# Altium schematic sheet Sheet1.SchDoc
size A0
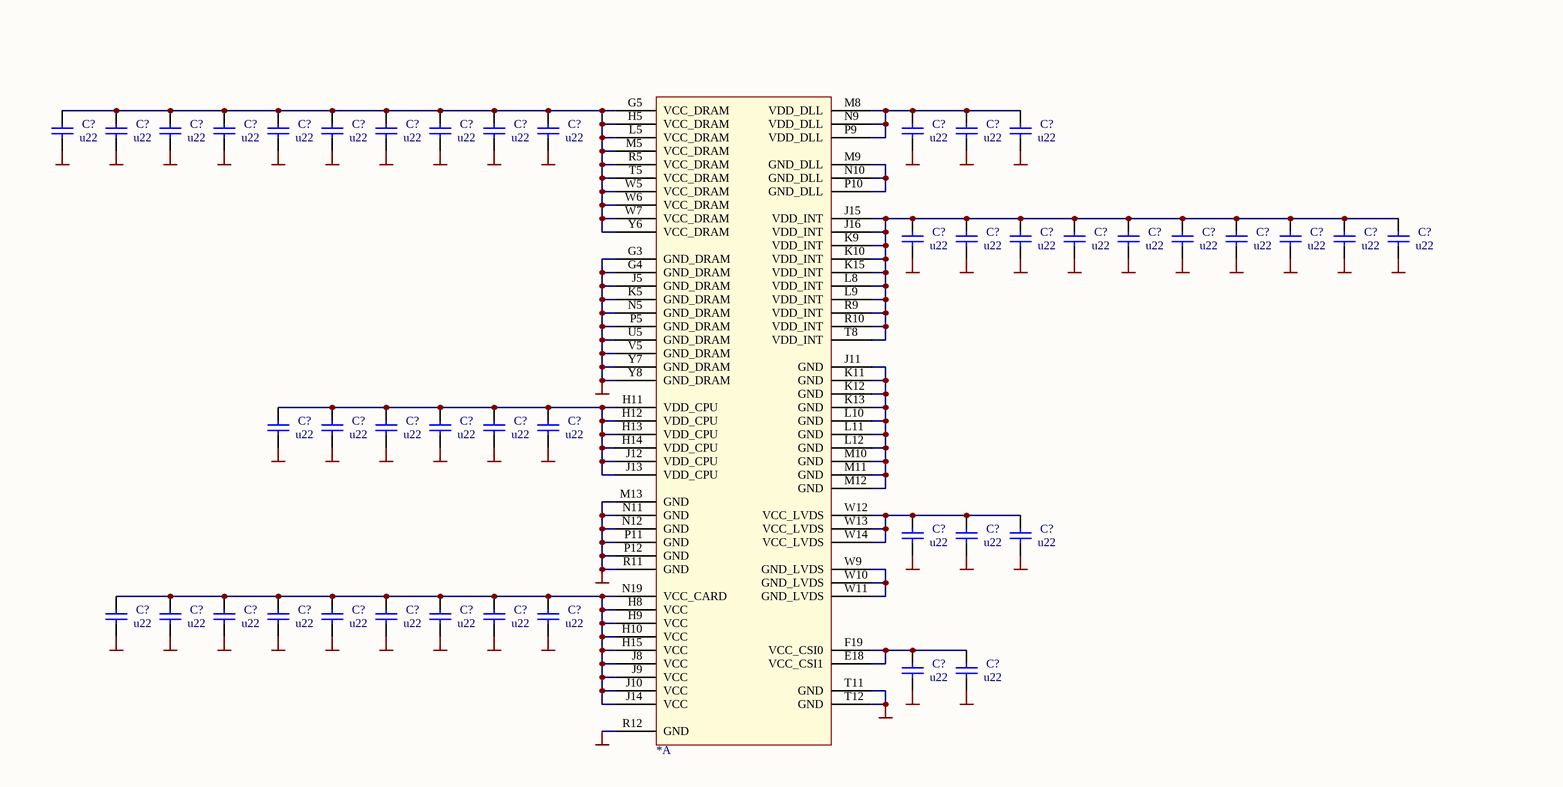
[diagram p0: Sheet1.SchDoc, top left]
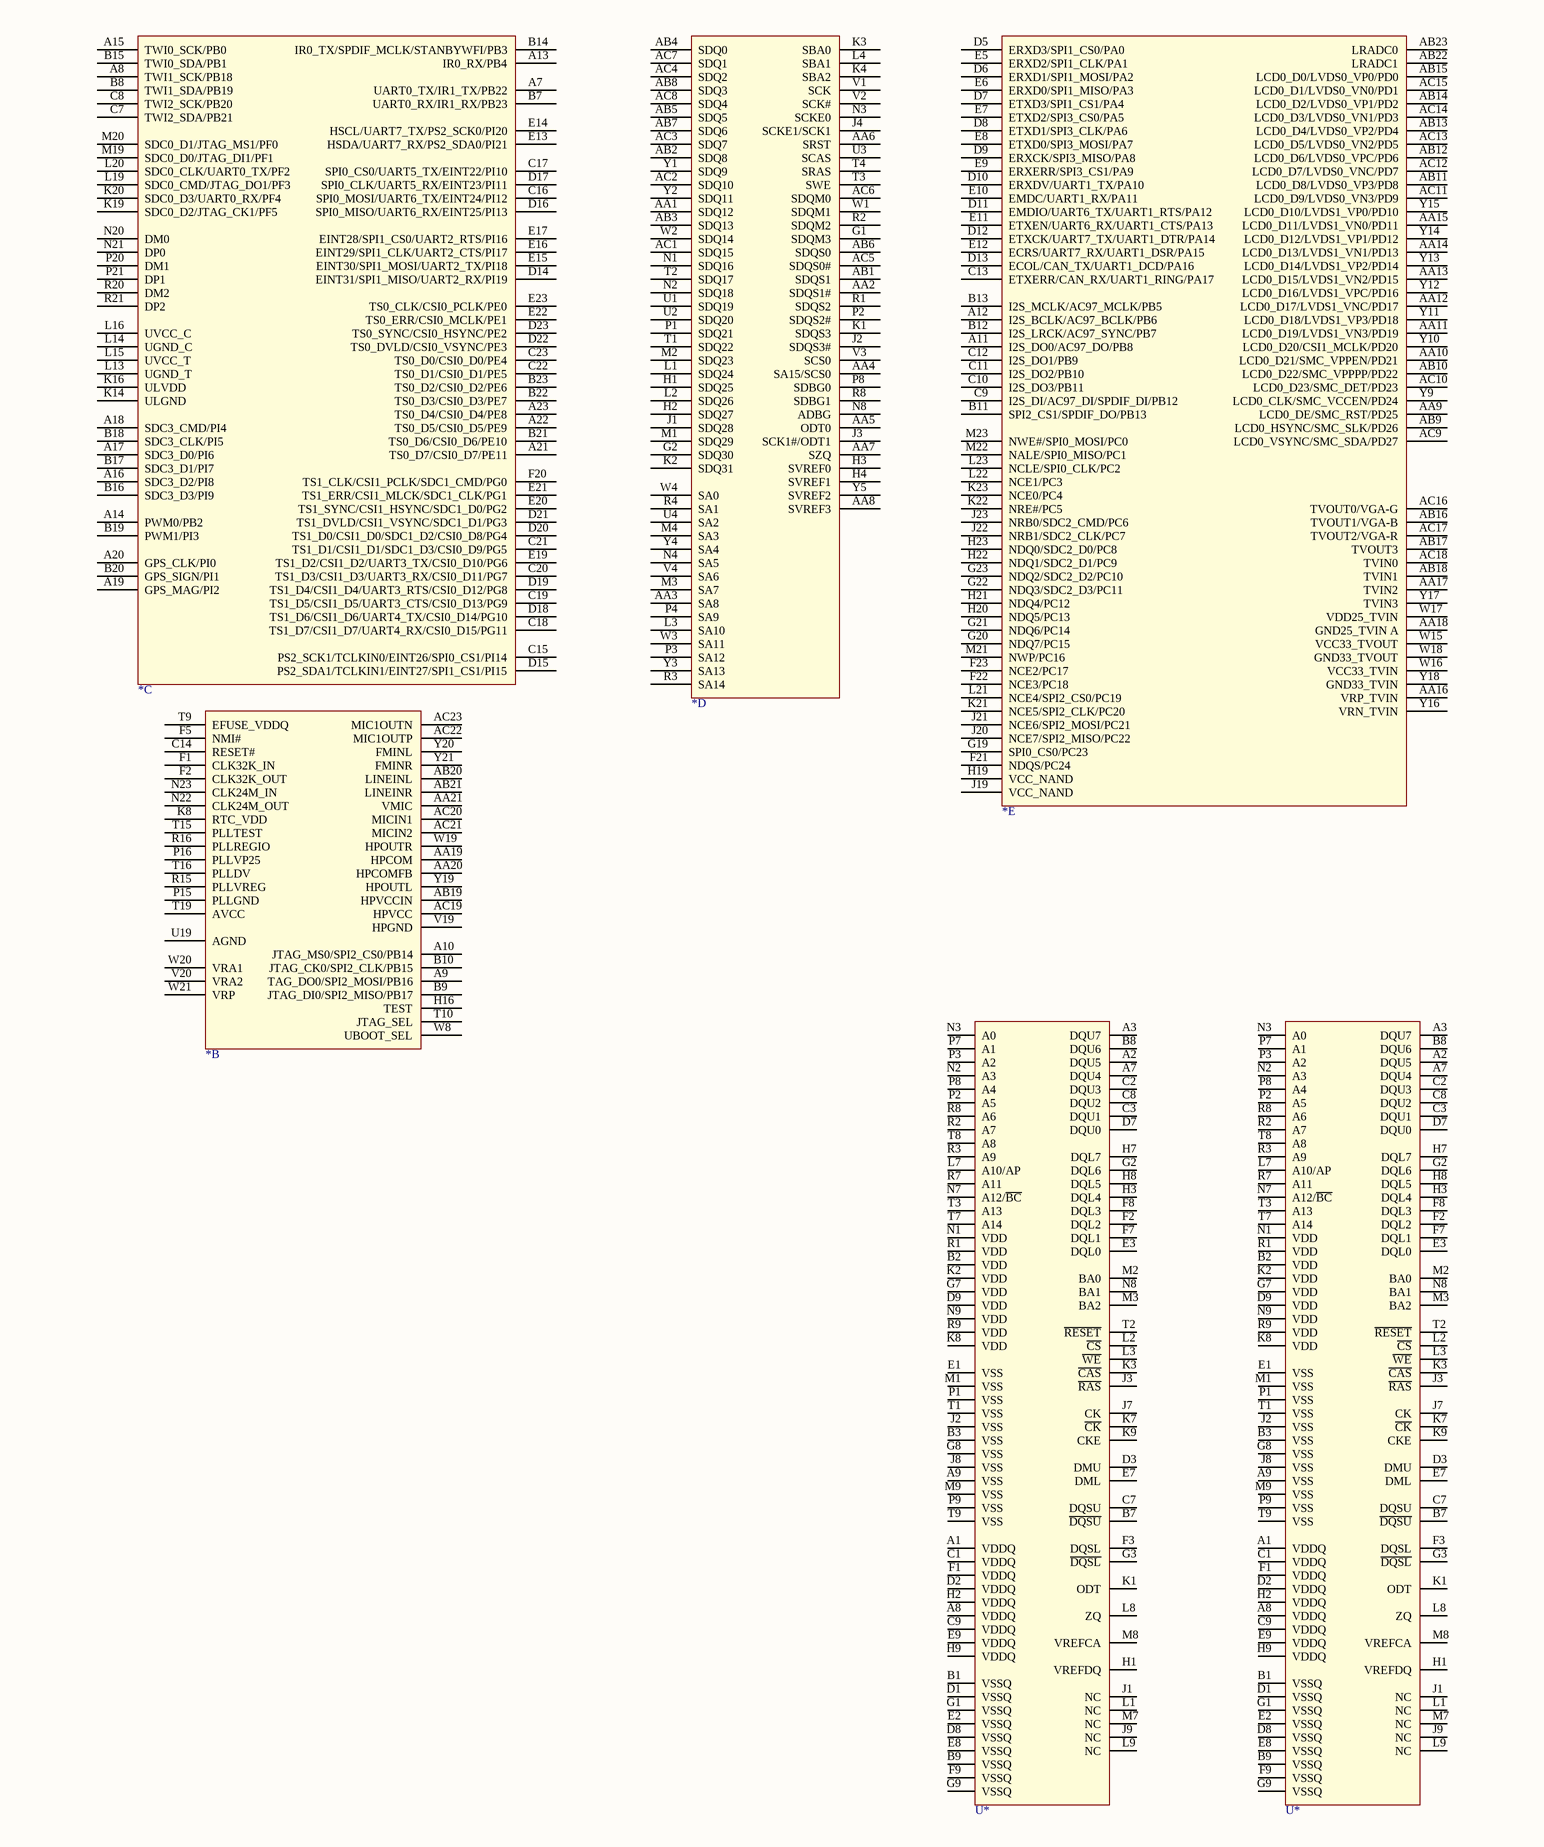
[diagram p1: Sheet1.SchDoc, top right]
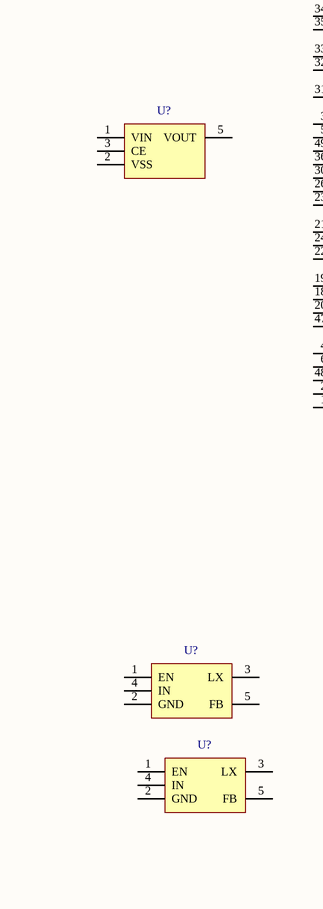
[diagram p2: Sheet1.SchDoc, bottom left]
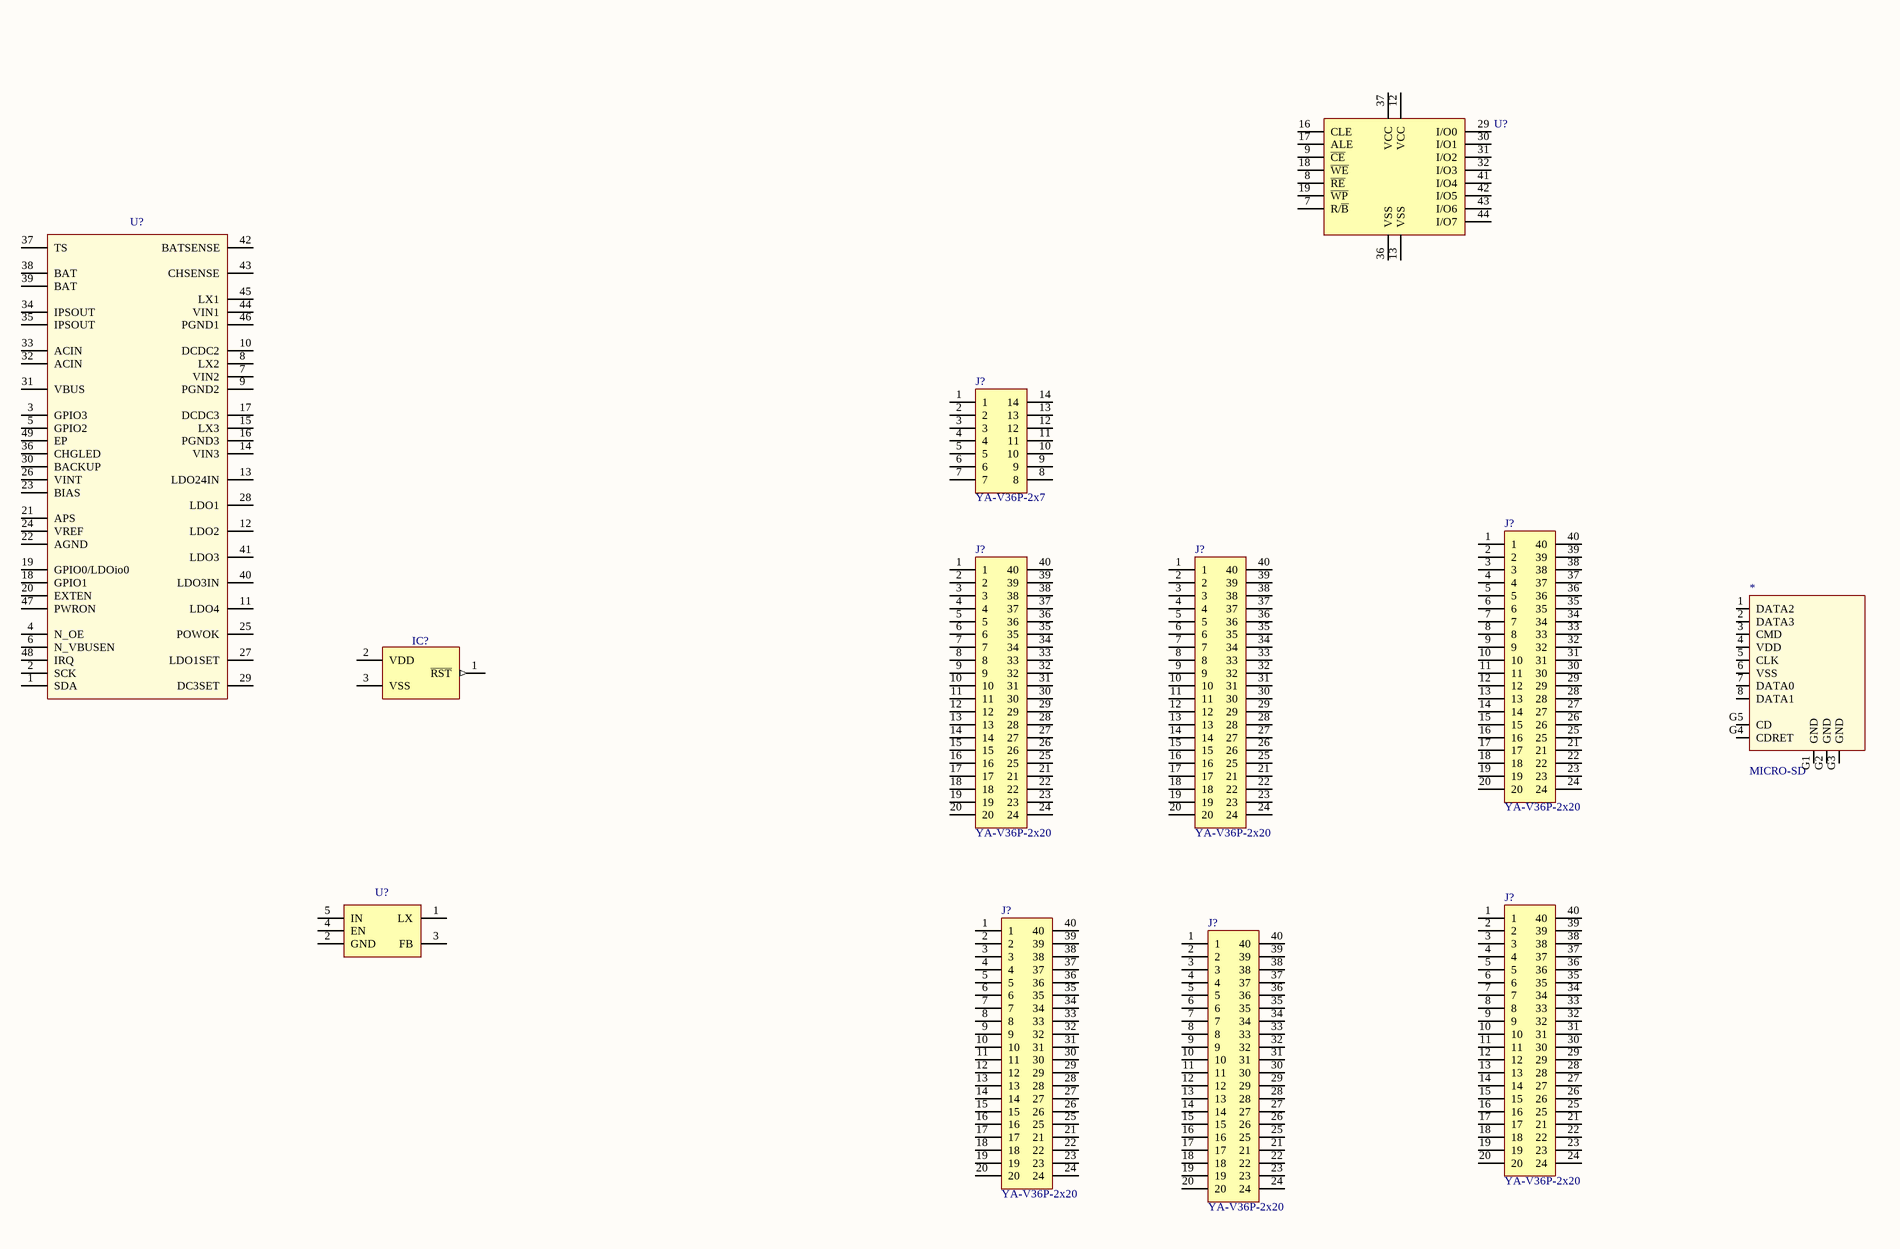
[diagram p3: Sheet1.SchDoc, bottom right]

## Parts
(Parts that share a designator on the sheet are numbered #1, #2 ... from top to bottom, then left to right.)
*#1  A20  [BGA441C80P23X23_1900X1900X140]  (value not drawn)  (part C of 6)
*#2  A20  [BGA441C80P23X23_1900X1900X140]  (value not drawn)  (part D of 6)
*#3  A20  [BGA441C80P23X23_1900X1900X140]  (value not drawn)  (part E of 6)
*#4  A20  [BGA441C80P23X23_1900X1900X140]  (value not drawn)  (part B of 6)
*#5  A20  [BGA441C80P23X23_1900X1900X140]  (value not drawn)  (part A of 6)
*#6  MICRO-SD  [MOLEX_0475710001]
C?#1  u22  [CAPC1005X55N]
C?#2  u22  [CAPC1005X55N]
C?#3  u22  [CAPC1005X55N]
C?#4  u22  [CAPC1005X55N]
C?#5  u22  [CAPC1005X55N]
C?#6  u22  [CAPC1005X55N]
C?#7  u22  [CAPC1005X55N]
C?#8  u22  [CAPC1005X55N]
C?#9  u22  [CAPC1005X55N]
C?#10  u22  [CAPC1005X55N]
C?#11  u22  [CAPC1005X55N]
C?#12  u22  [CAPC1005X55N]
C?#13  u22  [CAPC1005X55N]
C?#14  u22  [CAPC1005X55N]
C?#15  u22  [CAPC1005X55N]
C?#16  u22  [CAPC1005X55N]
C?#17  u22  [CAPC1005X55N]
C?#18  u22  [CAPC1005X55N]
C?#19  u22  [CAPC1005X55N]
C?#20  u22  [CAPC1005X55N]
C?#21  u22  [CAPC1005X55N]
C?#22  u22  [CAPC1005X55N]
C?#23  u22  [CAPC1005X55N]
C?#24  u22  [CAPC1005X55N]
C?#25  u22  [CAPC1005X55N]
C?#26  u22  [CAPC1005X55N]
C?#27  u22  [CAPC1005X55N]
C?#28  u22  [CAPC1005X55N]
C?#29  u22  [CAPC1005X55N]
C?#30  u22  [CAPC1005X55N]
C?#31  u22  [CAPC1005X55N]
C?#32  u22  [CAPC1005X55N]
C?#33  u22  [CAPC1005X55N]
C?#34  u22  [CAPC1005X55N]
C?#35  u22  [CAPC1005X55N]
C?#36  u22  [CAPC1005X55N]
C?#37  u22  [CAPC1005X55N]
C?#38  u22  [CAPC1005X55N]
C?#39  u22  [CAPC1005X55N]
C?#40  u22  [CAPC1005X55N]
C?#41  u22  [CAPC1005X55N]
C?#42  u22  [CAPC1005X55N]
C?#43  u22  [CAPC1005X55N]
IC?  MCP120  [SOT95P237X112-3N]  (value not drawn)
J?#1  YA-V36P-2x7  [YA-V36P-2x7]
J?#2  YA-V36P-2x20  [YA-V36P-2x20]
J?#3  YA-V36P-2x20  [YA-V36P-2x20]
J?#4  YA-V36P-2x20  [YA-V36P-2x20]
J?#5  YA-V36P-2x20  [YA-V36P-2x20]
J?#6  YA-V36P-2x20  [YA-V36P-2x20]
J?#7  YA-V36P-2x20  [YA-V36P-2x20]
U*#1  K4B4G1646D  [BGA96C80P9X16_900X1400X120]  (value not drawn)
U*#2  K4B4G1646D  [BGA96C80P9X16_900X1400X120]  (value not drawn)
U?#1  H27UBG8T2BTR  [BGA96C80P9X16_900X1400X120]  (value not drawn)
U?#2  AXP209  [QFN40P600X600X100-49N-S440]  (value not drawn)
U?#3  AP1231  [SOT95P280X110-5N]  (value not drawn)
U?#4  SY7208  [SOT95P280X145-6N]  (value not drawn)
U?#5  SY8009A  [SOT95P280X110-5N]  (value not drawn)
U?#6  SY8009A  [SOT95P280X110-5N]  (value not drawn)

## Nets
GND: *#5.G3(GND_DRAM) *#5.G4(GND_DRAM) *#5.J5(GND_DRAM) *#5.K5(GND_DRAM) *#5.M13(GND) *#5.N5(GND_DRAM) *#5.N11(GND) *#5.N12(GND) *#5.P5(GND_DRAM) *#5.P11(GND) *#5.P12(GND) *#5.R11(GND) *#5.R12(GND) *#5.T11(GND) *#5.T12(GND) *#5.U5(GND_DRAM) *#5.V5(GND_DRAM) *#5.Y7(GND_DRAM) *#5.Y8(GND_DRAM) C?#1.1 C?#2.1 C?#3.1 C?#4.1 C?#5.1 C?#6.1 C?#7.1 C?#8.1 C?#9.1 C?#10.1 C?#11.1 C?#12.1 C?#13.1 C?#14.1 C?#15.1 C?#16.1 C?#17.1 C?#18.1 C?#19.1 C?#20.1 C?#21.1 C?#22.1 C?#23.1 C?#24.1 C?#25.1 C?#26.1 C?#27.1 C?#28.1 C?#29.1 C?#30.1 C?#31.1 C?#32.1 C?#33.1 C?#34.1 C?#35.1 C?#36.1 C?#37.1 C?#38.1 C?#39.1 C?#40.1 C?#41.1 C?#42.1 C?#43.1
Net*#5_E18: *#5.E18(VCC_CSI1) *#5.F19(VCC_CSI0) C?#42.2 C?#43.2
Net*#5_G5: *#5.G5(VCC_DRAM) *#5.H5(VCC_DRAM) *#5.L5(VCC_DRAM) *#5.M5(VCC_DRAM) *#5.R5(VCC_DRAM) *#5.T5(VCC_DRAM) *#5.W5(VCC_DRAM) *#5.W6(VCC_DRAM) *#5.W7(VCC_DRAM) *#5.Y6(VCC_DRAM) C?#1.2 C?#2.2 C?#3.2 C?#4.2 C?#5.2 C?#6.2 C?#7.2 C?#8.2 C?#9.2 C?#10.2
Net*#5_H8: *#5.H8(VCC) *#5.H9(VCC) *#5.H10(VCC) *#5.H15(VCC) *#5.J8(VCC) *#5.J9(VCC) *#5.J10(VCC) *#5.J14(VCC) *#5.N19(VCC_CARD) C?#33.2 C?#34.2 C?#35.2 C?#36.2 C?#37.2 C?#38.2 C?#39.2 C?#40.2 C?#41.2
Net*#5_H11: *#5.H11(VDD_CPU) *#5.H12(VDD_CPU) *#5.H13(VDD_CPU) *#5.H14(VDD_CPU) *#5.J12(VDD_CPU) *#5.J13(VDD_CPU) C?#24.2 C?#25.2 C?#26.2 C?#27.2 C?#28.2 C?#29.2
Net*#5_J11: *#5.J11(GND) *#5.K11(GND) *#5.K12(GND) *#5.K13(GND) *#5.L10(GND) *#5.L11(GND) *#5.L12(GND) *#5.M10(GND) *#5.M11(GND) *#5.M12(GND)
Net*#5_J15: *#5.J15(VDD_INT) *#5.J16(VDD_INT) *#5.K9(VDD_INT) *#5.K10(VDD_INT) *#5.K15(VDD_INT) *#5.L8(VDD_INT) *#5.L9(VDD_INT) *#5.R9(VDD_INT) *#5.R10(VDD_INT) *#5.T8(VDD_INT) C?#14.2 C?#15.2 C?#16.2 C?#17.2 C?#18.2 C?#19.2 C?#20.2 C?#21.2 C?#22.2 C?#23.2
Net*#5_M8: *#5.M8(VDD_DLL) *#5.N9(VDD_DLL) *#5.P9(VDD_DLL) C?#11.2 C?#12.2 C?#13.2
Net*#5_M9: *#5.M9(GND_DLL) *#5.N10(GND_DLL) *#5.P10(GND_DLL)
Net*#5_W9: *#5.W9(GND_LVDS) *#5.W10(GND_LVDS) *#5.W11(GND_LVDS)
Net*#5_W12: *#5.W12(VCC_LVDS) *#5.W13(VCC_LVDS) *#5.W14(VCC_LVDS) C?#30.2 C?#31.2 C?#32.2

Not connected (* = marked no-connect by the designer): *#1 A7(UART0_TX/IR1_TX/PB22) A8(TWI1_SCK/PB18) A13(IR0_RX/PB4) A14(PWM0/PB2) A15(TWI0_SCK/PB0) A16(SDC3_D2/PI8) A17(SDC3_D0/PI6) A18(SDC3_CMD/PI4) A19(GPS_MAG/PI2) A20(GPS_CLK/PI0) A21(TS0_D7/CSI0_D7/PE11) A22(TS0_D5/CSI0_D5/PE9) A23(TS0_D4/CSI0_D4/PE8) B7(UART0_RX/IR1_RX/PB23) B8(TWI1_SDA/PB19) B14(IR0_TX/SPDIF_MCLK/STANBYWFI/PB3) B15(TWI0_SDA/PB1) B16(SDC3_D3/PI9) B17(SDC3_D1/PI7) B18(SDC3_CLK/PI5) B19(PWM1/PI3) B20(GPS_SIGN/PI1) B21(TS0_D6/CSI0_D6/PE10) B22(TS0_D3/CSI0_D3/PE7) B23(TS0_D2/CSI0_D2/PE6) C7(TWI2_SDA/PB21) C8(TWI2_SCK/PB20) C15(PS2_SCK1/TCLKIN0/EINT26/SPI0_CS1/PI14) C16(SPI0_MOSI/UART6_TX/EINT24/PI12) C17(SPI0_CS0/UART5_TX/EINT22/PI10) C18(TS1_D7/CSI1_D7/UART4_RX/CSI0_D15/PG11) C19(TS1_D5/CSI1_D5/UART3_CTS/CSI0_D13/PG9) C20(TS1_D3/CSI1_D3/UART3_RX/CSI0_D11/PG7) C21(TS1_D1/CSI1_D1/SDC1_D3/CSI0_D9/PG5) C22(TS0_D1/CSI0_D1/PE5) C23(TS0_D0/CSI0_D0/PE4) D14(EINT31/SPI1_MISO/UART2_RX/PI19) D15(PS2_SDA1/TCLKIN1/EINT27/SPI1_CS1/PI15) D16(SPI0_MISO/UART6_RX/EINT25/PI13) D17(SPI0_CLK/UART5_RX/EINT23/PI11) D18(TS1_D6/CSI1_D6/UART4_TX/CSI0_D14/PG10) D19(TS1_D4/CSI1_D4/UART3_RTS/CSI0_D12/PG8) D20(TS1_D0/CSI1_D0/SDC1_D2/CSI0_D8/PG4) D21(TS1_DVLD/CSI1_VSYNC/SDC1_D1/PG3) D22(TS0_DVLD/CSI0_VSYNC/PE3) D23(TS0_SYNC/CSI0_HSYNC/PE2) E13(HSDA/UART7_RX/PS2_SDA0/PI21) E14(HSCL/UART7_TX/PS2_SCK0/PI20) E15(EINT30/SPI1_MOSI/UART2_TX/PI18) E16(EINT29/SPI1_CLK/UART2_CTS/PI17) E17(EINT28/SPI1_CS0/UART2_RTS/PI16) E19(TS1_D2/CSI1_D2/UART3_TX/CSI0_D10/PG6) E20(TS1_SYNC/CSI1_HSYNC/SDC1_D0/PG2) E21(TS1_ERR/CSI1_MLCK/SDC1_CLK/PG1) E22(TS0_ERR/CSI0_MCLK/PE1) E23(TS0_CLK/CSI0_PCLK/PE0) F20(TS1_CLK/CSI1_PCLK/SDC1_CMD/PG0) K14(ULGND) K16(ULVDD) K19(SDC0_D2/JTAG_CK1/PF5) K20(SDC0_D3/UART0_RX/PF4) L13(UGND_T) L14(UGND_C) L15(UVCC_T) L16(UVCC_C) L19(SDC0_CMD/JTAG_DO1/PF3) L20(SDC0_CLK/UART0_TX/PF2) M19(SDC0_D0/JTAG_DI1/PF1) M20(SDC0_D1/JTAG_MS1/PF0) N20(DM0) N21(DP0) P20(DM1) P21(DP1) R20(DM2) R21(DP2); *#2 AA1(SDQ12) AA2(SDQS1#) AA3(SA8) AA4(SA15/SCS0) AA5(ODT0) AA6(SRST) AA7(SZQ) AA8(SVREF3) AB1(SDQS1) AB2(SDQ8) AB3(SDQ13) AB4(SDQ0) AB5(SDQ5) AB6(SDQS0) AB7(SDQ6) AB8(SDQ3) AC1(SDQ15) AC2(SDQ10) AC3(SDQ7) AC4(SDQ2) AC5(SDQS0#) AC6(SDQM0) AC7(SDQ1) AC8(SDQ4) G1(SDQM3) G2(SDQ30) H1(SDQ25) H2(SDQ27) H3(SVREF0) H4(SVREF1) J1(SDQ28) J2(SDQS3#) J3(SCK1#/ODT1) J4(SCKE1/SCK1) K1(SDQS3) K2(SDQ31) K3(SBA0) K4(SBA2) L1(SDQ24) L2(SDQ26) L3(SA10) L4(SBA1) M1(SDQ29) M2(SDQ23) M3(SA7) M4(SA3) N1(SDQ16) N2(SDQ18) N3(SCKE0) N4(SA5) N8(ADBG) P1(SDQ21) P2(SDQS2#) P3(SA12) P4(SA9) P8(SDBG0) R1(SDQS2) R2(SDQM2) R3(SA14) R4(SA1) R8(SDBG1) T1(SDQ22) T2(SDQ17) T3(SWE) T4(SRAS) U1(SDQ19) U2(SDQ20) U3(SCAS) U4(SA2) V1(SCK) V2(SCK#) V3(SCS0) V4(SA6) W1(SDQM1) W2(SDQ14) W3(SA11) W4(SA0) Y1(SDQ9) Y2(SDQ11) Y3(SA13) Y4(SA4) Y5(SVREF2); *#3 A11(I2S_DO0/AC97_DO/PB8) A12(I2S_BCLK/AC97_BCLK/PB6) AA9(LCD0_DE/SMC_RST/PD25) AA10(LCD0_D21/SMC_VPPEN/PD21) AA11(LCD0_D19/LVDS1_VN3/PD19) AA12(LCD0_D17/LVDS1_VNC/PD17) AA13(LCD0_D15/LVDS1_VN2/PD15) AA14(LCD0_D13/LVDS1_VN1/PD13) AA15(LCD0_D11/LVDS1_VN0/PD11) AA16(VRP_TVIN) AA17(TVIN2) AA18(GND25_TVIN_A) AB9(LCD0_HSYNC/SMC_SLK/PD26) AB10(LCD0_D22/SMC_VPPPP/PD22) AB11(LCD0_D8/LVDS0_VP3/PD8) AB12(LCD0_D6/LVDS0_VPC/PD6) AB13(LCD0_D4/LVDS0_VP2/PD4) AB14(LCD0_D2/LVDS0_VP1/PD2) AB15(LCD0_D0/LVDS0_VP0/PD0) AB16(TVOUT1/VGA-B) AB17(TVOUT3) AB18(TVIN1) AB22(LRADC1) AB23(LRADC0) AC9(LCD0_VSYNC/SMC_SDA/PD27) AC10(LCD0_D23/SMC_DET/PD23) AC11(LCD0_D9/LVDS0_VN3/PD9) AC12(LCD0_D7/LVDS0_VNC/PD7) AC13(LCD0_D5/LVDS0_VN2/PD5) AC14(LCD0_D3/LVDS0_VN1/PD3) AC15(LCD0_D1/LVDS0_VN0/PD1) AC16(TVOUT0/VGA-G) AC17(TVOUT2/VGA-R) AC18(TVIN0) B11(SPI2_CS1/SPDIF_DO/PB13) B12(I2S_LRCK/AC97_SYNC/PB7) B13(I2S_MCLK/AC97_MCLK/PB5) C9(I2S_DI/AC97_DI/SPDIF_DI/PB12) C10(I2S_DO3/PB11) C11(I2S_DO2/PB10) C12(I2S_DO1/PB9) C13(ETXERR/CAN_RX/UART1_RING/PA17) D5(ERXD3/SPI1_CS0/PA0) D6(ERXD1/SPI1_MOSI/PA2) D7(ETXD3/SPI1_CS1/PA4) D8(ETXD1/SPI3_CLK/PA6) D9(ERXCK/SPI3_MISO/PA8) D10(ERXDV/UART1_TX/PA10) D11(EMDIO/UART6_TX/UART1_RTS/PA12) D12(ETXCK/UART7_TX/UART1_DTR/PA14) D13(ECOL/CAN_TX/UART1_DCD/PA16) E5(ERXD2/SPI1_CLK/PA1) E6(ERXD0/SPI1_MISO/PA3) E7(ETXD2/SPI3_CS0/PA5) E8(ETXD0/SPI3_MOSI/PA7) E9(ERXERR/SPI3_CS1/PA9) E10(EMDC/UART1_RX/PA11) E11(ETXEN/UART6_RX/UART1_CTS/PA13) E12(ECRS/UART7_RX/UART1_DSR/PA15) F21(NDQS/PC24) F22(NCE3/PC18) F23(NCE2/PC17) G19(SPI0_CS0/PC23) G20(NDQ7/PC15) G21(NDQ6/PC14) G22(NDQ3/SDC2_D3/PC11) G23(NDQ2/SDC2_D2/PC10) H19(VCC_NAND) H20(NDQ5/PC13) H21(NDQ4/PC12) H22(NDQ1/SDC2_D1/PC9) H23(NDQ0/SDC2_D0/PC8) J19(VCC_NAND) J20(NCE7/SPI2_MISO/PC22) J21(NCE6/SPI2_MOSI/PC21) J22(NRB1/SDC2_CLK/PC7) J23(NRB0/SDC2_CMD/PC6) K21(NCE5/SPI2_CLK/PC20) K22(NRE#/PC5) K23(NCE0/PC4) L21(NCE4/SPI2_CS0/PC19) L22(NCE1/PC3) L23(NCLE/SPI0_CLK/PC2) M21(NWP/PC16) M22(NALE/SPI0_MISO/PC1) M23(NWE#/SPI0_MOSI/PC0) W15(VCC33_TVOUT) W16(VCC33_TVIN) W17(VDD25_TVIN) W18(GND33_TVOUT) Y9(LCD0_CLK/SMC_VCCEN/PD24) Y10(LCD0_D20/CSI1_MCLK/PD20) Y11(LCD0_D18/LVDS1_VP3/PD18) Y12(LCD0_D16/LVDS1_VPC/PD16) Y13(LCD0_D14/LVDS1_VP2/PD14) Y14(LCD0_D12/LVDS1_VP1/PD12) Y15(LCD0_D10/LVDS1_VP0/PD10) Y16(VRN_TVIN) Y17(TVIN3) Y18(GND33_TVIN); *#4 A9(TAG_DO0/SPI2_MOSI/PB16) A10(JTAG_MS0/SPI2_CS0/PB14) AA19(HPCOM) AA20(HPCOMFB) AA21(VMIC) AB19(HPVCCIN) AB20(LINEINL) AB21(LINEINR) AC19(HPVCC) AC20(MICIN1) AC21(MICIN2) AC22(MIC1OUTP) AC23(MIC1OUTN) B9(JTAG_DI0/SPI2_MISO/PB17) B10(JTAG_CK0/SPI2_CLK/PB15) C14(RESET#) F1(CLK32K_IN) F2(CLK32K_OUT) F5(NMI#) H16(TEST) K8(RTC_VDD) N22(CLK24M_OUT) N23(CLK24M_IN) P15(PLLGND) P16(PLLVP25) R15(PLLVREG) R16(PLLREGIO) T9(EFUSE_VDDQ) T10(JTAG_SEL) T15(PLLTEST) T16(PLLDV) T19(AVCC) U19(AGND) V19(HPGND) V20(VRA2) W8(UBOOT_SEL) W19(HPOUTR) W20(VRA1) W21(VRP) Y19(HPOUTL) Y20(FMINL) Y21(FMINR); *#6 1(DATA2) 2(DATA3) 3(CMD) 4(VDD) 5(CLK) 6(VSS) 7(DATA0) 8(DATA1) G1(GND) G2(GND) G3(GND) G4(CDRET) G5(CD); IC? 1(~{RST}) 2(VDD) 3(VSS); J?#1 1 2 3 4 5 6 7 8 9 10 11 12 13 14; J?#2 1 2 3 4 5 6 7 8 9 10 11 12 13 14 15 16 17 18 19 20 21 22 23 24 25 26 27 28 29 30 31 32 33 34 35 36 37 38 39 40; J?#3 1 2 3 4 5 6 7 8 9 10 11 12 13 14 15 16 17 18 19 20 21 22 23 24 25 26 27 28 29 30 31 32 33 34 35 36 37 38 39 40; J?#4 1 2 3 4 5 6 7 8 9 10 11 12 13 14 15 16 17 18 19 20 21 22 23 24 25 26 27 28 29 30 31 32 33 34 35 36 37 38 39 40; J?#5 1 2 3 4 5 6 7 8 9 10 11 12 13 14 15 16 17 18 19 20 21 22 23 24 25 26 27 28 29 30 31 32 33 34 35 36 37 38 39 40; J?#6 1 2 3 4 5 6 7 8 9 10 11 12 13 14 15 16 17 18 19 20 21 22 23 24 25 26 27 28 29 30 31 32 33 34 35 36 37 38 39 40; J?#7 1 2 3 4 5 6 7 8 9 10 11 12 13 14 15 16 17 18 19 20 21 22 23 24 25 26 27 28 29 30 31 32 33 34 35 36 37 38 39 40; U*#1 A1(VDDQ) A2(DQU5) A3(DQU7) A7(DQU4) A8(VDDQ) A9(VSS) B1(VSSQ) B2(VDD) B3(VSS) B7(~{DQSU}) B8(DQU6) B9(VSSQ) C1(VDDQ) C2(DQU3) C3(DQU1) C7(DQSU) C8(DQU2) C9(VDDQ) D1(VSSQ) D2(VDDQ) D3(DMU) D7(DQU0) D8(VSSQ) D9(VDD) E1(VSS) E2(VSSQ) E3(DQL0) E7(DML) E8(VSSQ) E9(VDDQ) F1(VDDQ) F2(DQL2) F3(DQSL) F7(DQL1) F8(DQL3) F9(VSSQ) G1(VSSQ) G2(DQL6) G3(~{DQSL}) G7(VDD) G8(VSS) G9(VSSQ) H1(VREFDQ) H2(VDDQ) H3(DQL4) H7(DQL7) H8(DQL5) H9(VDDQ) J1(NC) J2(VSS) J3(~{RAS}) J7(CK) J8(VSS) J9(NC) K1(ODT) K2(VDD) K3(~{CAS}) K7(~{CK}) K8(VDD) K9(CKE) L1(NC) L2(~{CS}) L3(~{WE}) L7(A10/AP) L8(ZQ) L9(NC) M1(VSS) M2(BA0) M3(BA2) M7(NC) M8(VREFCA) M9(VSS) N1(VDD) N2(A3) N3(A0) N7(A12/~{BC}) N8(BA1) N9(VDD) P1(VSS) P2(A5) P3(A2) P7(A1) P8(A4) P9(VSS) R1(VDD) R2(A7) R3(A9) R7(A11) R8(A6) R9(VDD) T1(VSS) T2(~{RESET}) T3(A13) T7(A14) T8(A8) T9(VSS); U*#2 A1(VDDQ) A2(DQU5) A3(DQU7) A7(DQU4) A8(VDDQ) A9(VSS) B1(VSSQ) B2(VDD) B3(VSS) B7(~{DQSU}) B8(DQU6) B9(VSSQ) C1(VDDQ) C2(DQU3) C3(DQU1) C7(DQSU) C8(DQU2) C9(VDDQ) D1(VSSQ) D2(VDDQ) D3(DMU) D7(DQU0) D8(VSSQ) D9(VDD) E1(VSS) E2(VSSQ) E3(DQL0) E7(DML) E8(VSSQ) E9(VDDQ) F1(VDDQ) F2(DQL2) F3(DQSL) F7(DQL1) F8(DQL3) F9(VSSQ) G1(VSSQ) G2(DQL6) G3(~{DQSL}) G7(VDD) G8(VSS) G9(VSSQ) H1(VREFDQ) H2(VDDQ) H3(DQL4) H7(DQL7) H8(DQL5) H9(VDDQ) J1(NC) J2(VSS) J3(~{RAS}) J7(CK) J8(VSS) J9(NC) K1(ODT) K2(VDD) K3(~{CAS}) K7(~{CK}) K8(VDD) K9(CKE) L1(NC) L2(~{CS}) L3(~{WE}) L7(A10/AP) L8(ZQ) L9(NC) M1(VSS) M2(BA0) M3(BA2) M7(NC) M8(VREFCA) M9(VSS) N1(VDD) N2(A3) N3(A0) N7(A12/~{BC}) N8(BA1) N9(VDD) P1(VSS) P2(A5) P3(A2) P7(A1) P8(A4) P9(VSS) R1(VDD) R2(A7) R3(A9) R7(A11) R8(A6) R9(VDD) T1(VSS) T2(~{RESET}) T3(A13) T7(A14) T8(A8) T9(VSS); U?#1 1(NC) 2(NC) 3(NC) 4(NC) 5(NC) 6(NC) 7(R/~{B}) 8(~{RE}) 9(~{CE}) 10(NC) 11(NC) 12(VCC) 13(VSS) 14(NC) 15(NC) 16(CLE) 17(ALE) 18(~{WE}) 19(~{WP}) 20(NC) 21(NC) 22(NC) 23(NC) 24(NC) 25(NC) 26(NC) 27(NC) 28(NC) 29(I/O0) 30(I/O1) 31(I/O2) 32(I/O3) 33(NC) 34(NC) 35(NC) 36(VSS) 37(VCC) 38(NC) 39(NC) 40(NC) 41(I/O4) 42(I/O5) 43(I/O6) 44(I/O7) 45(NC) 46(NC) 47(NC) 48(NC); U?#2 1(SDA) 2(SCK) 3(GPIO3) 4(N_OE) 5(GPIO2) 6(N_VBUSEN) 7(VIN2) 8(LX2) 9(PGND2) 10(DCDC2) 11(LDO4) 12(LDO2) 13(LDO24IN) 14(VIN3) 15(LX3) 16(PGND3) 17(DCDC3) 18(GPIO1) 19(GPIO0/LDOio0) 20(EXTEN) 21(APS) 22(AGND) 23(BIAS) 24(VREF) 25(POWOK) 26(VINT) 27(LDO1SET) 28(LDO1) 29(DC3SET) 30(BACKUP) 31(VBUS) 32(ACIN) 33(ACIN) 34(IPSOUT) 35(IPSOUT) 36(CHGLED) 37(TS) 38(BAT) 39(BAT) 40(LDO3IN) 41(LDO3) 42(BATSENSE) 43(CHSENSE) 44(VIN1) 45(LX1) 46(PGND1) 47(PWRON) 48(IRQ) 49(EP); U?#3 1(VIN) 2(VSS) 3(CE) 4(NC) 5(VOUT); U?#4 1(LX) 2(GND) 3(FB) 4(EN) 5(IN) 6(NC); U?#5 1(EN) 2(GND) 3(LX) 4(IN) 5(FB); U?#6 1(EN) 2(GND) 3(LX) 4(IN) 5(FB)

## Notes on the sheet
- Title
- Size:
- Date:
- File:
- A0
- Number:
- Time:
- Revision:
- Sheet
- of

## Library data of the parts
*#1-*#5 = A20: Part Description: Dual-core CPU; Manufacturer: Allwinner Technology; Part Number: A20; Component Kind: Standard; Component Type: Standard; Device: A20; PackageDescription: BGA, 0.80mm Pitch, Square; 441 Pin, 23 Columns X 23 Rows, 19.00mm X 19.00mm X 1.40mm H; Manufacturer Part Number: A20; Pin Count: 441; Case: FBGA441; Mounted: Yes; Socket: No; SMD: Yes; ComponentHeight: 1.4mm; HelpURL: https://svn.eftek.net/A20-SOM/A20 Brief 2013-02-27.pdf; Author: Vadym; CreateDate: 24-Oct-16; LatestRevisionDate: 24-Oct-16
*#6 = MICRO-SD_MOLEX_0475710001: Part Description: Micro-SD Card Holder; Manufacturer: MOLEX; Part Number: MICRO-SD_MOLEX_0475710001; Component Kind: Standard; Component Type: Standard; Pin Count: 15; Family: micro-SD; Mounted: Yes; Socket: No; SMD: Yes; Status: None; Manufacturer Part Number: 0475710001; ComponentHeight: 2.3mm; HelpURL: E:\svn\eftek\library\doc\DS_SPICE\connectors\SDCMF-10901W0T0.pdfD:\library\doc\DS_SPICE\connectors\microSD\Molex\0475710001\475710001_sd.pdf; Author: ELMAN; CreateDate: 19-May-15; LatestRevisionDate: 19-May-15
C?#1-C?#43 = CC0402_220NF_6.3V_10%_X5R: Non-polarised capacitor; Part Description: SMD Multilayer Chip Ceramic Capacitor; Manufacturer: GENERIC; Manufacturer1 Part Number: GRM155R60J474KE19D; Voltage: 6.3V; TC: X5R; Tolerance: ±10%; Part Number: CC0402_220NF_6.3V_10%_X5R; Component Kind: Standard; Component Type: Standard; Pin Count: 2; Value: u22; Status: Preferred; Manufacturer Part Number: CC0402_220NF_6.3V_10%_X5R; Case: 0402; Mounted: Yes; Socket: No; SMD: Yes; Manufacturer1 Example: KEMET; Manufacturer1 ComponentHeight: 0.55mm; HelpURL: \\cern.ch\dfs\Applications\Altium\Datasheets\CC0402_X5R_KEMET.pdf; Author: CERN DEM JLC; CreateDate: 22-Apr-10; LatestRevisionDate: 22-Apr-10
IC? = MCP120T-475I: 4.625V Microcontroller Supervisory Circuit With Open Drain Output; Manufacturer: MICROCHIP TECHNOLOGY; Manufacturer Part Number: MCP809T-315I/TT; Part Number: MCP120T-475I; Component Kind: Standard; Component Type: Standard; Device: MCP120; PackageDescription: SOT, 0.95mm, pitch; 3 pin,1.30mm W X 2.92mm L X 1.12mm H body, IPC Medium Density; Part Description: 4.625V Microcontroller Supervisory Circuit With Open Drain Output; Pin Count: 3; Case: SOT23; Mounted: Yes; Socket: No; SMD: Yes; ComponentHeight: 1.12mm; Author: Vadym; HelpURL: http://www.mouser.com/ds/2/268/11184d-68220.pdf; CreateDate: 25-Oct-16; LatestRevisionDate: 25-Oct-16
J?#1 = YA-V36P-2x7: Dual Row 1.27x1.27 SMD (H = 3.6 mm); Manufacturer: Morethanall; Mounted: No; LatestRevisionDate: 25-Oct-16; LatestRevisionNote: Re-released for DXP Platform.; Publisher: Altium Limited; Part Number: YA-V36P-2x7; Component Kind: Standard; Component Type: Standard; Pin Count: 14; Family: Header 14; Socket: No; SMD: Yes; Status: None; Part Description: Dual Row 1.27x1.27 SMD (H = 3.6 mm); Manufacturer Part Number: YA-V36P-2x7; ComponentHeight: 2mm; HelpURL: http://www.morethanall.com/upload/products_pdf/1267391278482147b1acc05.pdf; Author: Vadym; CreateDate: 25-Oct-16
J?#2-J?#7 = YA-V36P-2x20: Dual Row 1.27x1.27 SMD (H = 3.6 mm); Manufacturer: Morethanall; Mounted: No; LatestRevisionDate: 25-Oct-16; LatestRevisionNote: Re-released for DXP Platform.; Publisher: Altium Limited; Part Number: YA-V36P-2x20; Component Kind: Standard; Component Type: Standard; Pin Count: 40; Family: Header 40; Socket: No; SMD: Yes; Status: None; Part Description: Dual Row 1.27x1.27 SMD (H = 3.6 mm); Manufacturer Part Number: YA-V36P-2x20; ComponentHeight: 2mm; HelpURL: http://www.morethanall.com/upload/products_pdf/1267391278482147b1acc05.pdf; Author: Vadym; CreateDate: 25-Oct-16
U*#1 U*#2 = K4B4G1646D: 4Gb D-die DDR3 SDRAM; Manufacturer: SAMSUNG; Part Number: K4B4G1646D; Component Kind: Standard; Component Type: Standard; Device: K4B4G1646D; PackageDescription: BGA 0.8mm, Pitch, Square 96 Pin, 9 Columns x 16 Rows, Body 14mm X 9mm X 1.2mm H; Part Description: 4Gb D-die DDR3 SDRAM; Manufacturer Part Number: K4B4G1646D; Pin Count: 96; Case: BGA96C80P9X16_900X1400X120; Mounted: Yes; Socket: No; SMD: Yes; ComponentHeight: 0.85mm; Author: Vadym; HelpURL: http://www.samsung.com/semiconductor/global/file/product/DS_K4B4G1646D-BC_I_P_Rev102.pdf; CreateDate: 24-Oct-16; LatestRevisionDate: 24-Oct-16
U?#1 = H27UBG8T2BTR: 32Gb(4096M x 8bit) Legacy MLC NAND Flash; Manufacturer: hynix; Manufacturer Part Number: H27UBG8T2BTR-BC; Published: 24-Aug-2001; LatestRevisionDate: 25-Oct-16; LatestRevisionNote: Stylized 3D Model Added.; DatasheetVersion: Sep-1999; PackageVersion: Jul-1998; PackageReference: TSSOP8; Publisher: Altium Limited; PackageDescription: SOP, 48-Leads, Body 18.45x12mm, Pitch 0.50mm, IPC Medium Density; ComponentLink1Description: Manufacturer Link; ComponentLink1URL: http://www.st.com/; ComponentLink2Description: Datasheet; ComponentLink2URL: http://www.st.com/stonline/products/literature/ds/5067/m24c01-r.pdf; Part Number: H27UBG8T2BTR; Component Kind: Standard; Component Type: Standard; Device: H27UBG8T2BTR; Footprint: SOP50P2000X120-48N; Part Description: 32Gb(4096M x 8bit) Legacy MLC NAND Flash; Pin Count: 48; Case: SOP50P2000X120-48N; Mounted: Yes; Socket: No; SMD: Yes; ComponentHeight: 1.2mm; Author: Vadym; HelpURL: https://www.olimex.com/Products/Components/IC/H27UBG8T2BTR/resources/H27UBG8T2BTR.pdf; CreateDate: 25-Oct-16
U?#2 = AXP209: Enhanced single Cell Li-Battery and Power System Management IC; Manufacturer: X-Powers; Part Number: AXP209; Component Kind: Standard; Component Type: Standard; Device: AXP209; PackageDescription: QFN, 0.40mm Pitch, Square; 48 Pin, 6.00mm L X 6.00mm W X 1.00mm H body (w/thermal tab 4.4 X 4.4mm), IPC Medium Density; Part Description: Enhanced single Cell Li-Battery and Power System Management IC; Manufacturer Part Number: AXP209; Pin Count: 49; Case: QFN48; Mounted: Yes; Socket: No; SMD: Yes; ComponentHeight: 1mm; HelpURL: https://svn.eftek.net/library/doc/DS_SPICE/ic/power_management/Voltage Regulators/AXP209/AXP209_Datasheet_v1.0en.pdf; Author: Vadym; CreateDate: 19-Oct-16; LatestRevisionDate: 19-Oct-16
U?#3 = AP1231: High Speed Low Dropout 300 mA Current Voltage Regulator; Manufacturer: Chipown; Part Number: AP1231; Component Kind: Standard; Component Type: Standard; Device: AP1231; PackageDescription: SOT23, 5-Leads, Body 1.6x3.0mm, Pitch 0.95mm, IPC Medium Density; Part Description: High Speed Low Dropout 300 mA Current Voltage Regulator; Manufacturer Part Number: AP1231; Pin Count: 5; Case: SOT23-5; Mounted: Yes; Socket: No; SMD: Yes; ComponentHeight: 1.45mm; HelpURL: http://hands.com/~lkcl/eoma/allwinner/AP1231.pdf; Author: Vadym; CreateDate: 25-Oct-16; LatestRevisionDate: 25-Oct-16
U?#4 = SY7208: High Efficiency 1MHz, 2A Step Up Regulator; Manufacturer: SILERGY; Part Number: SY7208; Component Kind: Standard; Component Type: Standard; Device: SY7208; PackageDescription: SOT23, 6-Leads, Body 1.6x3.0mm, Pitch 0.95mm, IPC Medium Density; Part Description: High Efficiency 1MHz, 2A Step Up Regulator; Manufacturer Part Number: SY7208; Pin Count: 6; Case: SOT23-6; Mounted: Yes; Socket: No; SMD: Yes; ComponentHeight: 1.45mm; HelpURL: http://wiki.chipspark.com/cn/images/a/a6/SY7208_Rev0.91_for_Rockchip.pdf; Author: Vadym; CreateDate: 25-Oct-16; LatestRevisionDate: 25-Oct-16
U?#5 U?#6 = SY8009A: High Efficiency 1.5MHz/1MHz, 1.5A/2A Synchronous Step Down Regulator; Manufacturer: SILERGY; Part Number: SY8009A; Component Kind: Standard; Component Type: Standard; Device: SY8009A; PackageDescription: SOT23, 5-Leads, Body 1.6x3.0mm, Pitch 0.95mm, IPC Medium Density; Part Description: High Efficiency 1.5MHz/1MHz, 1.5A/2A Synchronous Step Down Regulator; Manufacturer Part Number: SY8009A; Pin Count: 5; Case: SOT23-5; Mounted: Yes; Socket: No; SMD: Yes; ComponentHeight: 1.45mm; HelpURL: https://www.olimex.com/Products/Breadboarding/BB-PWR-8009/resources/SY8009.pdf; Author: Vadym; CreateDate: 25-Oct-16; LatestRevisionDate: 25-Oct-16